# Altium schematic sheet RS232-485.SchDoc: RS232/RS485 Transceiver
size A; DocumentNumber: 9; SheetNumber: 9; SheetTotal: 11
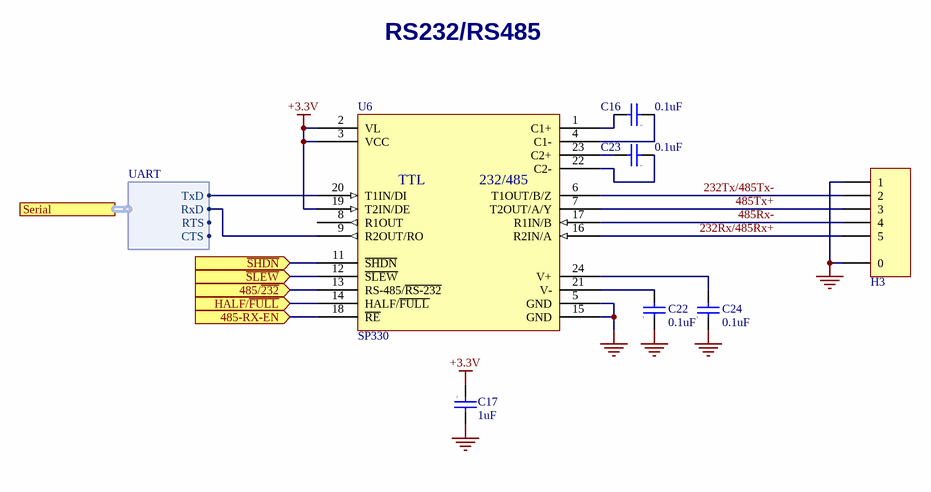
[diagram p0: RS232-485.SchDoc]

## Parts
C16  value 0.1uF  [0402]  (hidden comment: Cap)
C17  value 1uF  [0603]  (hidden comment: Cap)
C22  value 0.1uF  [0402]  (hidden comment: Cap)
C23  value 0.1uF  [0402]  (hidden comment: Cap)
C24  value 0.1uF  [0402]  (hidden comment: Cap)
H3  Hdr - 5pin - mount  [SM05B-GHS-TB(LF)(SN)]  (value not drawn)
U6  SP330  [TSOP65P640X120-24N]

## Ports
485-RX-EN (in), 485/~{232} (in), HALF/~{FULL} (in), Serial (harness UART), ~{SHDN} (in), ~{SLEW} (in)

## Harnesses
UART: RxD, TxD, RTS, CTS

## Nets
+3.3V: C17.1 U6.2(VL) U6.3(VCC) U6.19(T2IN/DE)
GND: C17.2 C22.1 C24.1 H3.0 H3.1 U6.5(GND) U6.15(GND)
232Rx/485Rx+: H3.5 U6.16(R2IN/A)
232Tx/485Tx-: H3.2 U6.6(T1OUT/B/Z)
485-RX-EN: U6.18(~{RE}) ; port 485-RX-EN
485/~{232}: U6.13(RS-485/~{RS-232}) ; port 485/~{232}
485Rx-: H3.4 U6.17(R1IN/B)
485Tx+: H3.3 U6.7(T2OUT/A/Y)
~{SHDN}: U6.11(~{SHDN}) ; port ~{SHDN}
~{SLEW}: U6.12(~{SLEW}) ; port ~{SLEW}
HALF/~{FULL}: U6.14(HALF/~{FULL}) ; port HALF/~{FULL}
NetC16_1: C16.1 U6.4(C1-)
NetC16_2: C16.2 U6.1(C1+)
NetC22_2: C22.2 U6.21(V-)
NetC23_1: C23.1 U6.22(C2-)
NetC23_2: C23.2 U6.23(C2+)
NetC24_2: C24.2 U6.24(V+)
NetU6_9: U6.9(R2OUT/RO) ; port Serial.RxD
NetU6_20: U6.20(T1IN/DI) ; port Serial.TxD

Not connected (* = marked no-connect by the designer): U6 8(R1OUT)

## Notes on the sheet
- RS232/RS485
- Date
- Sheet
- Project
- Time
- PCB
- Assy
- of
- Size
- A
- File
- (in symbol SP330) TTL; 232/485

## Library data of the parts
C16 C22-C24 = Cap: CAP CER .10UF 50V X7R 10% 0402; Manufacturer: TDK Corporation; Manufacturer Part Number: C1005X7R1H104K; Capacitance: 0.1µF; Published: 8-Jun-2000; LatestRevisionDate: 17-Jul-2002; LatestRevisionNote: Re-released for DXP Platform.; Publisher: Altium Limited; Category: Capacitors; Supplier 1: Digi-Key; Supplier Part Number 1: 445-5932-1-ND; RoHS: RoHS Compliant; Stock 1: 174080; Pricing 1: 1=0.3, 10=0.2, 100=0.08, 250=0.05752, 500=0.041, 1000=0.03 (USD); Voltage - Rated: 50V; Tolerance: ±10%; Temperature Coefficient: X7R; Mounting Type: Surface Mount, MLCC; Operating Temperature: -55°C ~ 125°C; Applications: General Purpose; Ratings: -; Package / Case: 0402 (1005 Metric); Size / Dimension: 0.039" L x 0.020" W (1.00mm x 0.50mm); Height: -; Thickness: 0.022" (0.55mm); Lead Spacing: -; Features: -; Packaging: Cut Tape (CT); Lead Style: -; ComponentLink1URL: http://www.tdk.co.jp/tefe02/e412_c.pdf; ComponentLink1Description: http://www.tdk.co.jp/tefe02/e412_c.pdf
C17 = Cap: CAP CER 1UF 25V X7R 0603; Manufacturer: Samsung; Manufacturer Part Number: CL10B105KA8NNNC; Tolerance: 10%; Published: 8-Jun-2000; LatestRevisionDate: 17-Jul-2002; LatestRevisionNote: Re-released for DXP Platform.; Publisher: Altium Limited; Category: Capacitors; Supplier 1: Digi-Key; Supplier Part Number 1: 1276-1184-6-ND; Stock 1: 0; Pricing 1: 1=0.1, 10=0.069, 100=0.0306, 500=0.02188, 1000=0.01719 (USD); Mount: Surface Mount; Case/Package: 0603; Case Code (Metric): 1608; Case Code (Imperial): 0603; Contact Plating: Tin; Min Operating Temperature: -55°C; Max Operating Temperature: 125°C; Capacitance: 1uF; Dielectric: X7R; Packaging: Tape and Reel; Voltage Rating: 25V; Package Quantity: 1; Voltage: 25V; Length: 1.6mm; Height: 0.8mm; Width: 0.031inch; Thickness: 0.035inch; Depth: 0.8mm; Radiation Hardening: No; ComponentLink1URL: https://datasheet.ciiva.com/16449/cl10b105ka8nnnc-16449544.pdf; ComponentLink1Description: https://datasheet.ciiva.com/16449/cl10b105ka8nnnc-16449544.pdf; ComponentLink2URL: https://datasheet.ciiva.com/15195/getdatasheetpartid-359554-15195726.pdf; ComponentLink2Description: https://datasheet.ciiva.com/15195/getdatasheetpartid-359554-15195726.pdf
H3 = Hdr - 5pin - mount: CONN HEADER GH SIDE 5POS 1.25MM; Manufacturer: JST; Current Rating: 1A; Voltage Rating: 50V; Number of Positions: 5; Connector Type: Outer Shroud Contact; Pitch: 0.049inch; Wire/Cable Gauge: 26AWG; Supplier 1: Digi-Key; Supplier Part Number 1: 455-1567-1-ND; Manufacturer Part Number: SM05B-GHS-TB(LF)(SN); Stock 1: 0; Mount: Surface Mount; Contact Plating: Tin; Contact Material: Bronze; Housing Colour: Natural; Housing Material: Nylon; Colour: Natural; Min Operating Temperature: -25°C; Max Operating Temperature: 85°C; Number of Rows: 1; Packaging: Tape and Reel; Termination: Solder; Number of Contacts: 5; Orientation: Right Angle; Fastening Type: Ramp; Voltage Rating (AC): 50V; Lead Free: Lead Free; REACH SVHC: No SVHC
U6 = SP330: IC TXRX RS232/485 24TSSOP; Manufacturer: Exar; Manufacturer Part Number: SP330EEY-L; Min Supply Voltage: 3V; Max Supply Voltage: 5.5V; Data Rate: 20Mbps; Interface: RS-232,RS-422,RS-485; Number of Drivers: 2; Simplex/Duplex: Full Duplex; Receiver Hysteresis: 25mV; Supplier 1: Digi-Key; Supplier Part Number 1: 1016-1977-ND; Stock 1: 4132; Mount: Surface Mount; Case/Package: TSSOP; Number of Pins: 24; Min Operating Temperature: -40°C; Max Operating Temperature: 85°C; Packaging: Rail/Tube; Package Quantity: 62; Length: 7.9mm; Height: 1.05mm; Width: 4.5mm; REACH SVHC: Unknown; Lead Free: Lead Free